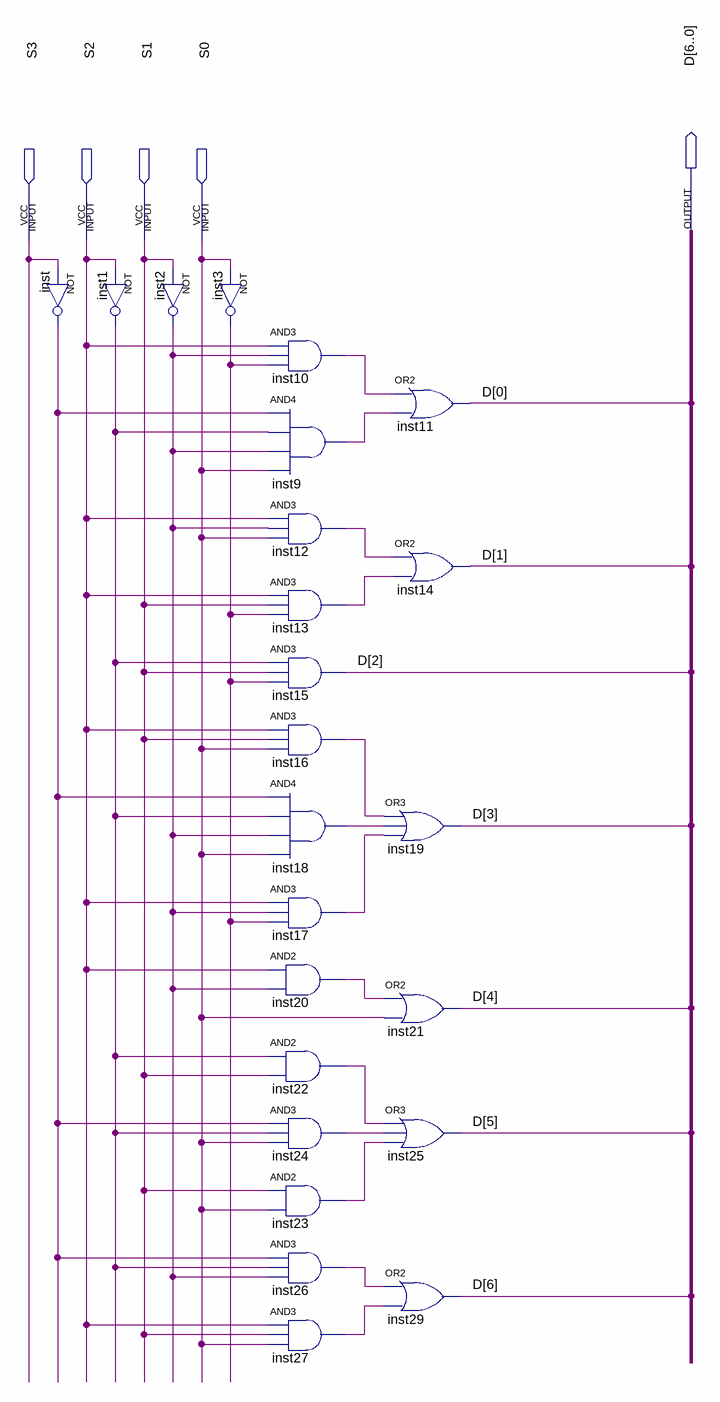
[diagram p0: schematic sheet]
// Quartus schematic DisplayBCD.bdf as structural Verilog: 24 symbols, 5 pins
module DisplayBCD (
  input  S3,
  input  S2,
  input  S1,
  input  S0,
  output [6:0] D
);

  wire inst1_out, inst2_out, inst3_out, inst9_out, inst10_out, inst12_out, inst13_out, inst16_out,
       inst17_out, inst18_out, inst20_out, inst22_out, inst23_out, inst24_out, inst26_out, inst27_out,
       inst_out;

  not inst (inst_out, S3);
  not inst1 (inst1_out, S2);
  not inst2 (inst2_out, S1);
  not inst3 (inst3_out, S0);
  and inst10 (inst10_out, S2, inst2_out, inst3_out);
  and inst9 (inst9_out, inst_out, inst1_out, inst2_out, S0);
  and inst12 (inst12_out, S2, inst2_out, S0);
  and inst13 (inst13_out, S2, S1, inst3_out);
  and inst15 (D[2], inst1_out, S1, inst3_out);
  and inst16 (inst16_out, S2, S1, S0);
  and inst18 (inst18_out, inst_out, inst1_out, inst2_out, S0);
  and inst17 (inst17_out, S2, inst2_out, inst3_out);
  and inst20 (inst20_out, S2, inst2_out);
  and inst22 (inst22_out, inst1_out, S1);
  and inst24 (inst24_out, inst_out, inst1_out, S0);
  and inst23 (inst23_out, S1, S0);
  and inst26 (inst26_out, inst_out, inst1_out, inst2_out);
  and inst27 (inst27_out, S2, S1, S0);
  or inst11 (D[0], inst10_out, inst9_out);
  or inst14 (D[1], inst12_out, inst13_out);
  or inst19 (D[3], inst16_out, inst18_out, inst17_out);
  or inst21 (D[4], inst20_out, S0);
  or inst25 (D[5], inst22_out, inst24_out, inst23_out);
  or inst29 (D[6], inst26_out, inst27_out);
endmodule
